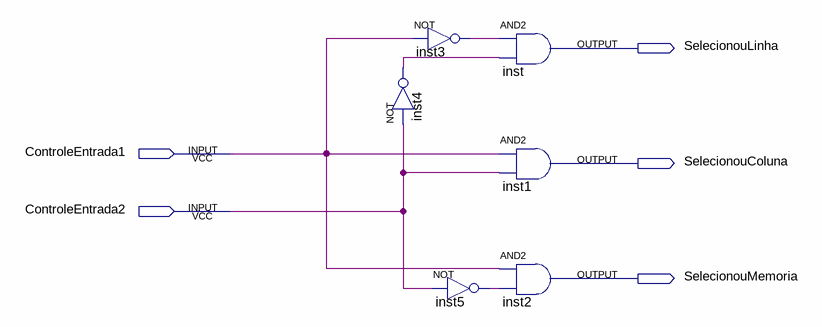
[diagram p0: schematic sheet]
// Quartus schematic ControleLeds.bdf as structural Verilog: 6 symbols, 5 pins
module ControleLeds (
  input  ControleEntrada1,
  input  ControleEntrada2,
  output SelecionouLinha,
  output SelecionouColuna,
  output SelecionouMemoria
);

  wire inst3_out, inst4_out, inst5_out;

  not inst4 (inst4_out, ControleEntrada2);
  not inst3 (inst3_out, ControleEntrada1);
  not inst5 (inst5_out, ControleEntrada2);
  and inst (SelecionouLinha, inst3_out, inst4_out);
  and inst1 (SelecionouColuna, ControleEntrada1, ControleEntrada2);
  and inst2 (SelecionouMemoria, ControleEntrada1, inst5_out);
endmodule
